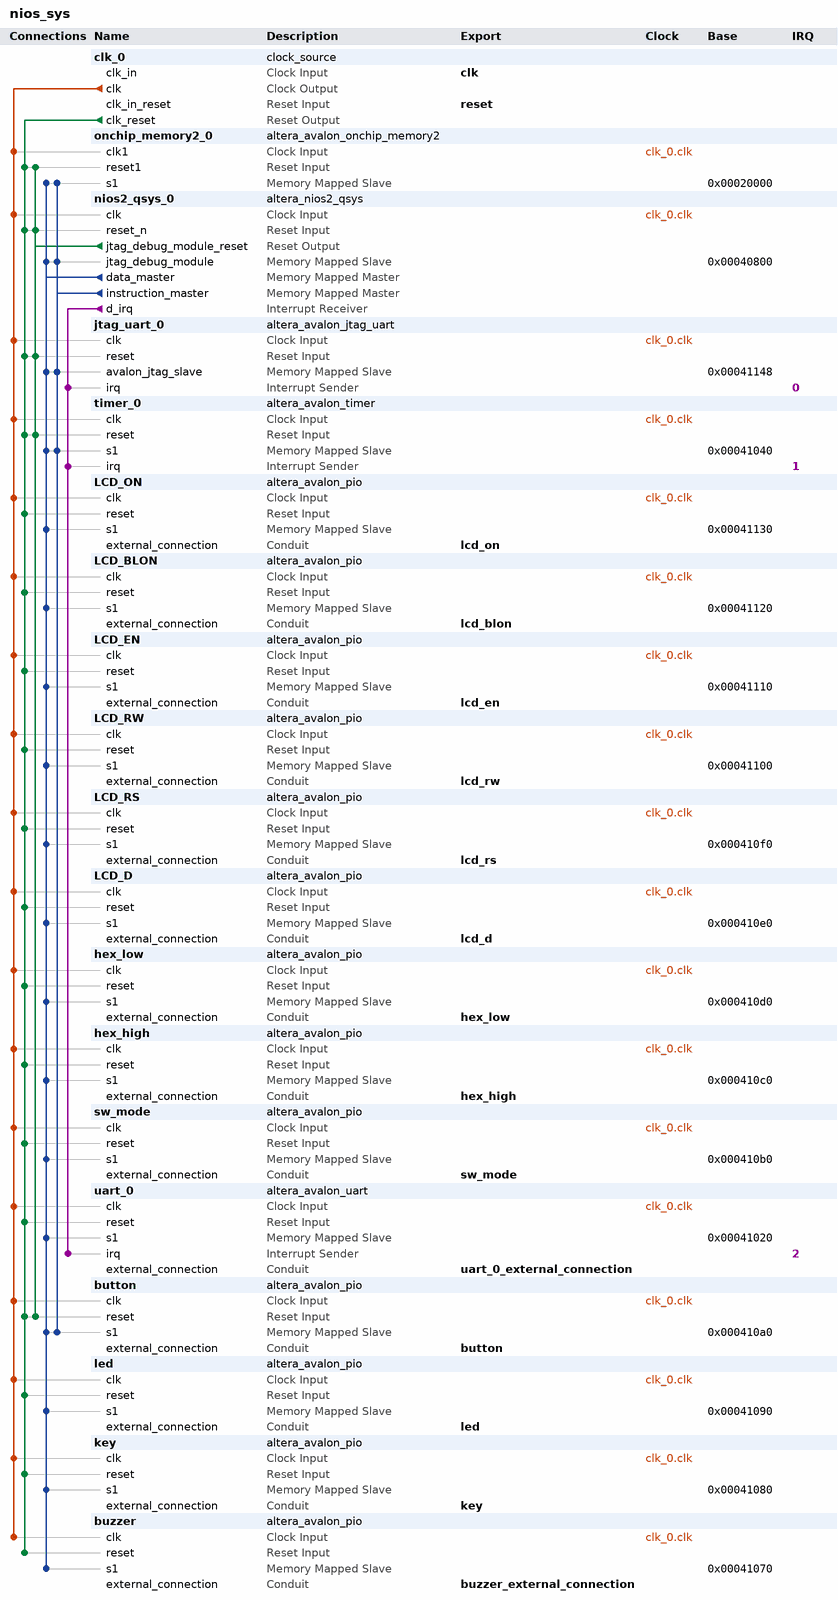
[diagram p0: system contents]
# Platform Designer (Qsys) system nios_sys, Cyclone IV E EP4CE115F29C8
# Parameters at their usual value, and those the tool derives, are not listed.
package require -exact qsys 13.0.1.99.2
create_system nios_sys
set_project_property DEVICE_FAMILY {Cyclone IV E}
set_project_property DEVICE EP4CE115F29C8

add_instance clk_0 clock_source 13.0
set_instance_parameter_value clk_0 clockFrequency 50000000

add_instance onchip_memory2_0 altera_avalon_onchip_memory2 13.0.1.99.2
set_instance_parameter_value onchip_memory2_0 dataWidth 32
set_instance_parameter_value onchip_memory2_0 dualPort false
set_instance_parameter_value onchip_memory2_0 initMemContent true
set_instance_parameter_value onchip_memory2_0 initializationFileName onchip_mem.hex
set_instance_parameter_value onchip_memory2_0 memorySize 81920

add_instance nios2_qsys_0 altera_nios2_qsys 13.0
set_instance_parameter_value nios2_qsys_0 resetSlave onchip_memory2_0.s1
set_instance_parameter_value nios2_qsys_0 mmu_TLBMissExcSlave None
set_instance_parameter_value nios2_qsys_0 exceptionSlave onchip_memory2_0.s1
set_instance_parameter_value nios2_qsys_0 breakSlave nios2_qsys_0.jtag_debug_module
set_instance_parameter_value nios2_qsys_0 impl Tiny
set_instance_parameter_value nios2_qsys_0 icache_size 4096

add_instance jtag_uart_0 altera_avalon_jtag_uart 13.0.1.99.2
set_instance_parameter_value jtag_uart_0 simInteractiveOptions NO_INTERACTIVE_WINDOWS

add_instance timer_0 altera_avalon_timer 13.0.1.99.2
set_instance_parameter_value timer_0 period 1
set_instance_parameter_value timer_0 periodUnits MSEC

add_instance LCD_ON altera_avalon_pio 13.0.1.99.2
set_instance_parameter_value LCD_ON direction Output
set_instance_parameter_value LCD_ON width 1

add_instance LCD_BLON altera_avalon_pio 13.0.1.99.2
set_instance_parameter_value LCD_BLON direction Output
set_instance_parameter_value LCD_BLON width 1

add_instance LCD_EN altera_avalon_pio 13.0.1.99.2
set_instance_parameter_value LCD_EN direction Output
set_instance_parameter_value LCD_EN width 1

add_instance LCD_RW altera_avalon_pio 13.0.1.99.2
set_instance_parameter_value LCD_RW direction Output
set_instance_parameter_value LCD_RW width 1

add_instance LCD_RS altera_avalon_pio 13.0.1.99.2
set_instance_parameter_value LCD_RS direction Output
set_instance_parameter_value LCD_RS width 1

add_instance LCD_D altera_avalon_pio 13.0.1.99.2
set_instance_parameter_value LCD_D direction Output
set_instance_parameter_value LCD_D width 8

add_instance hex_low altera_avalon_pio 13.0.1.99.2
set_instance_parameter_value hex_low direction Output
set_instance_parameter_value hex_low width 32

add_instance hex_high altera_avalon_pio 13.0.1.99.2
set_instance_parameter_value hex_high direction Output
set_instance_parameter_value hex_high width 32

add_instance sw_mode altera_avalon_pio 13.0.1.99.2
set_instance_parameter_value sw_mode direction Input
set_instance_parameter_value sw_mode width 4

add_instance uart_0 altera_avalon_uart 13.0.1.99.2
set_instance_parameter_value uart_0 baud 9600
set_instance_parameter_value uart_0 dataBits 8
set_instance_parameter_value uart_0 fixedBaud true
set_instance_parameter_value uart_0 parity NONE
set_instance_parameter_value uart_0 stopBits 1

add_instance button altera_avalon_pio 13.0.1.99.2
set_instance_parameter_value button direction Input
set_instance_parameter_value button width 4

add_instance led altera_avalon_pio 13.0.1.99.2
set_instance_parameter_value led direction Output
set_instance_parameter_value led width 32

add_instance key altera_avalon_pio 13.0.1.99.2
set_instance_parameter_value key direction Input
set_instance_parameter_value key width 8

add_instance buzzer altera_avalon_pio 13.0.1.99.2
set_instance_parameter_value buzzer direction Output
set_instance_parameter_value buzzer width 1

# connections
add_connection clk_0.clk button.clk clock
add_connection clk_0.clk buzzer.clk clock
add_connection clk_0.clk hex_high.clk clock
add_connection clk_0.clk hex_low.clk clock
add_connection clk_0.clk jtag_uart_0.clk clock
add_connection clk_0.clk key.clk clock
add_connection clk_0.clk LCD_BLON.clk clock
add_connection clk_0.clk LCD_D.clk clock
add_connection clk_0.clk LCD_EN.clk clock
add_connection clk_0.clk LCD_ON.clk clock
add_connection clk_0.clk LCD_RS.clk clock
add_connection clk_0.clk LCD_RW.clk clock
add_connection clk_0.clk led.clk clock
add_connection clk_0.clk nios2_qsys_0.clk clock
add_connection clk_0.clk onchip_memory2_0.clk1 clock
add_connection clk_0.clk sw_mode.clk clock
add_connection clk_0.clk timer_0.clk clock
add_connection clk_0.clk uart_0.clk clock
add_connection clk_0.clk_reset button.reset reset
add_connection clk_0.clk_reset buzzer.reset reset
add_connection clk_0.clk_reset hex_high.reset reset
add_connection clk_0.clk_reset hex_low.reset reset
add_connection clk_0.clk_reset jtag_uart_0.reset reset
add_connection clk_0.clk_reset key.reset reset
add_connection clk_0.clk_reset LCD_BLON.reset reset
add_connection clk_0.clk_reset LCD_D.reset reset
add_connection clk_0.clk_reset LCD_EN.reset reset
add_connection clk_0.clk_reset LCD_ON.reset reset
add_connection clk_0.clk_reset LCD_RS.reset reset
add_connection clk_0.clk_reset LCD_RW.reset reset
add_connection clk_0.clk_reset led.reset reset
add_connection clk_0.clk_reset nios2_qsys_0.reset_n reset
add_connection clk_0.clk_reset onchip_memory2_0.reset1 reset
add_connection clk_0.clk_reset sw_mode.reset reset
add_connection clk_0.clk_reset timer_0.reset reset
add_connection clk_0.clk_reset uart_0.reset reset
add_connection nios2_qsys_0.jtag_debug_module_reset button.reset reset
add_connection nios2_qsys_0.jtag_debug_module_reset jtag_uart_0.reset reset
add_connection nios2_qsys_0.jtag_debug_module_reset nios2_qsys_0.reset_n reset
add_connection nios2_qsys_0.jtag_debug_module_reset onchip_memory2_0.reset1 reset
add_connection nios2_qsys_0.jtag_debug_module_reset timer_0.reset reset
add_connection nios2_qsys_0.data_master button.s1 avalon
set_connection_parameter_value nios2_qsys_0.data_master/button.s1 baseAddress 0x000410a0
add_connection nios2_qsys_0.data_master buzzer.s1 avalon
set_connection_parameter_value nios2_qsys_0.data_master/buzzer.s1 baseAddress 0x00041070
add_connection nios2_qsys_0.data_master hex_high.s1 avalon
set_connection_parameter_value nios2_qsys_0.data_master/hex_high.s1 baseAddress 0x000410c0
add_connection nios2_qsys_0.data_master hex_low.s1 avalon
set_connection_parameter_value nios2_qsys_0.data_master/hex_low.s1 baseAddress 0x000410d0
add_connection nios2_qsys_0.data_master jtag_uart_0.avalon_jtag_slave avalon
set_connection_parameter_value nios2_qsys_0.data_master/jtag_uart_0.avalon_jtag_slave baseAddress 0x00041148
add_connection nios2_qsys_0.data_master key.s1 avalon
set_connection_parameter_value nios2_qsys_0.data_master/key.s1 baseAddress 0x00041080
add_connection nios2_qsys_0.data_master LCD_BLON.s1 avalon
set_connection_parameter_value nios2_qsys_0.data_master/LCD_BLON.s1 baseAddress 0x00041120
add_connection nios2_qsys_0.data_master LCD_D.s1 avalon
set_connection_parameter_value nios2_qsys_0.data_master/LCD_D.s1 baseAddress 0x000410e0
add_connection nios2_qsys_0.data_master LCD_EN.s1 avalon
set_connection_parameter_value nios2_qsys_0.data_master/LCD_EN.s1 baseAddress 0x00041110
add_connection nios2_qsys_0.data_master LCD_ON.s1 avalon
set_connection_parameter_value nios2_qsys_0.data_master/LCD_ON.s1 baseAddress 0x00041130
add_connection nios2_qsys_0.data_master LCD_RS.s1 avalon
set_connection_parameter_value nios2_qsys_0.data_master/LCD_RS.s1 baseAddress 0x000410f0
add_connection nios2_qsys_0.data_master LCD_RW.s1 avalon
set_connection_parameter_value nios2_qsys_0.data_master/LCD_RW.s1 baseAddress 0x00041100
add_connection nios2_qsys_0.data_master led.s1 avalon
set_connection_parameter_value nios2_qsys_0.data_master/led.s1 baseAddress 0x00041090
add_connection nios2_qsys_0.data_master nios2_qsys_0.jtag_debug_module avalon
set_connection_parameter_value nios2_qsys_0.data_master/nios2_qsys_0.jtag_debug_module baseAddress 0x00040800
add_connection nios2_qsys_0.data_master onchip_memory2_0.s1 avalon
set_connection_parameter_value nios2_qsys_0.data_master/onchip_memory2_0.s1 baseAddress 0x00020000
add_connection nios2_qsys_0.data_master sw_mode.s1 avalon
set_connection_parameter_value nios2_qsys_0.data_master/sw_mode.s1 baseAddress 0x000410b0
add_connection nios2_qsys_0.data_master timer_0.s1 avalon
set_connection_parameter_value nios2_qsys_0.data_master/timer_0.s1 baseAddress 0x00041040
add_connection nios2_qsys_0.data_master uart_0.s1 avalon
set_connection_parameter_value nios2_qsys_0.data_master/uart_0.s1 baseAddress 0x00041020
add_connection nios2_qsys_0.instruction_master button.s1 avalon
set_connection_parameter_value nios2_qsys_0.instruction_master/button.s1 baseAddress 0x000410a0
add_connection nios2_qsys_0.instruction_master jtag_uart_0.avalon_jtag_slave avalon
set_connection_parameter_value nios2_qsys_0.instruction_master/jtag_uart_0.avalon_jtag_slave baseAddress 0x00041148
add_connection nios2_qsys_0.instruction_master nios2_qsys_0.jtag_debug_module avalon
set_connection_parameter_value nios2_qsys_0.instruction_master/nios2_qsys_0.jtag_debug_module baseAddress 0x00040800
add_connection nios2_qsys_0.instruction_master onchip_memory2_0.s1 avalon
set_connection_parameter_value nios2_qsys_0.instruction_master/onchip_memory2_0.s1 baseAddress 0x00020000
add_connection nios2_qsys_0.instruction_master timer_0.s1 avalon
set_connection_parameter_value nios2_qsys_0.instruction_master/timer_0.s1 baseAddress 0x00041040
add_connection nios2_qsys_0.d_irq jtag_uart_0.irq interrupt
set_connection_parameter_value nios2_qsys_0.d_irq/jtag_uart_0.irq irqNumber 0
add_connection nios2_qsys_0.d_irq timer_0.irq interrupt
set_connection_parameter_value nios2_qsys_0.d_irq/timer_0.irq irqNumber 1
add_connection nios2_qsys_0.d_irq uart_0.irq interrupt
set_connection_parameter_value nios2_qsys_0.d_irq/uart_0.irq irqNumber 2

# exported interfaces
add_interface clk clock sink
set_interface_property clk EXPORT_OF clk_0.clk_in
add_interface reset reset sink
set_interface_property reset EXPORT_OF clk_0.clk_in_reset
add_interface lcd_on conduit end
set_interface_property lcd_on EXPORT_OF LCD_ON.external_connection
add_interface hex_low conduit end
set_interface_property hex_low EXPORT_OF hex_low.external_connection
add_interface lcd_blon conduit end
set_interface_property lcd_blon EXPORT_OF LCD_BLON.external_connection
add_interface lcd_rw conduit end
set_interface_property lcd_rw EXPORT_OF LCD_RW.external_connection
add_interface lcd_rs conduit end
set_interface_property lcd_rs EXPORT_OF LCD_RS.external_connection
add_interface lcd_d conduit end
set_interface_property lcd_d EXPORT_OF LCD_D.external_connection
add_interface hex_high conduit end
set_interface_property hex_high EXPORT_OF hex_high.external_connection
add_interface sw_mode conduit end
set_interface_property sw_mode EXPORT_OF sw_mode.external_connection
add_interface lcd_en conduit end
set_interface_property lcd_en EXPORT_OF LCD_EN.external_connection
add_interface uart_0_external_connection conduit end
set_interface_property uart_0_external_connection EXPORT_OF uart_0.external_connection
add_interface button conduit end
set_interface_property button EXPORT_OF button.external_connection
add_interface led conduit end
set_interface_property led EXPORT_OF led.external_connection
add_interface key conduit end
set_interface_property key EXPORT_OF key.external_connection
add_interface buzzer_external_connection conduit end
set_interface_property buzzer_external_connection EXPORT_OF buzzer.external_connection

set_interconnect_requirement {$system} qsys_mm.clockCrossingAdapter HANDSHAKE
set_interconnect_requirement {$system} qsys_mm.maxAdditionalLatency 1

save_system nios_sys.qsys
